# EAGLE design controlmodule (EAGLE 9.6.2)
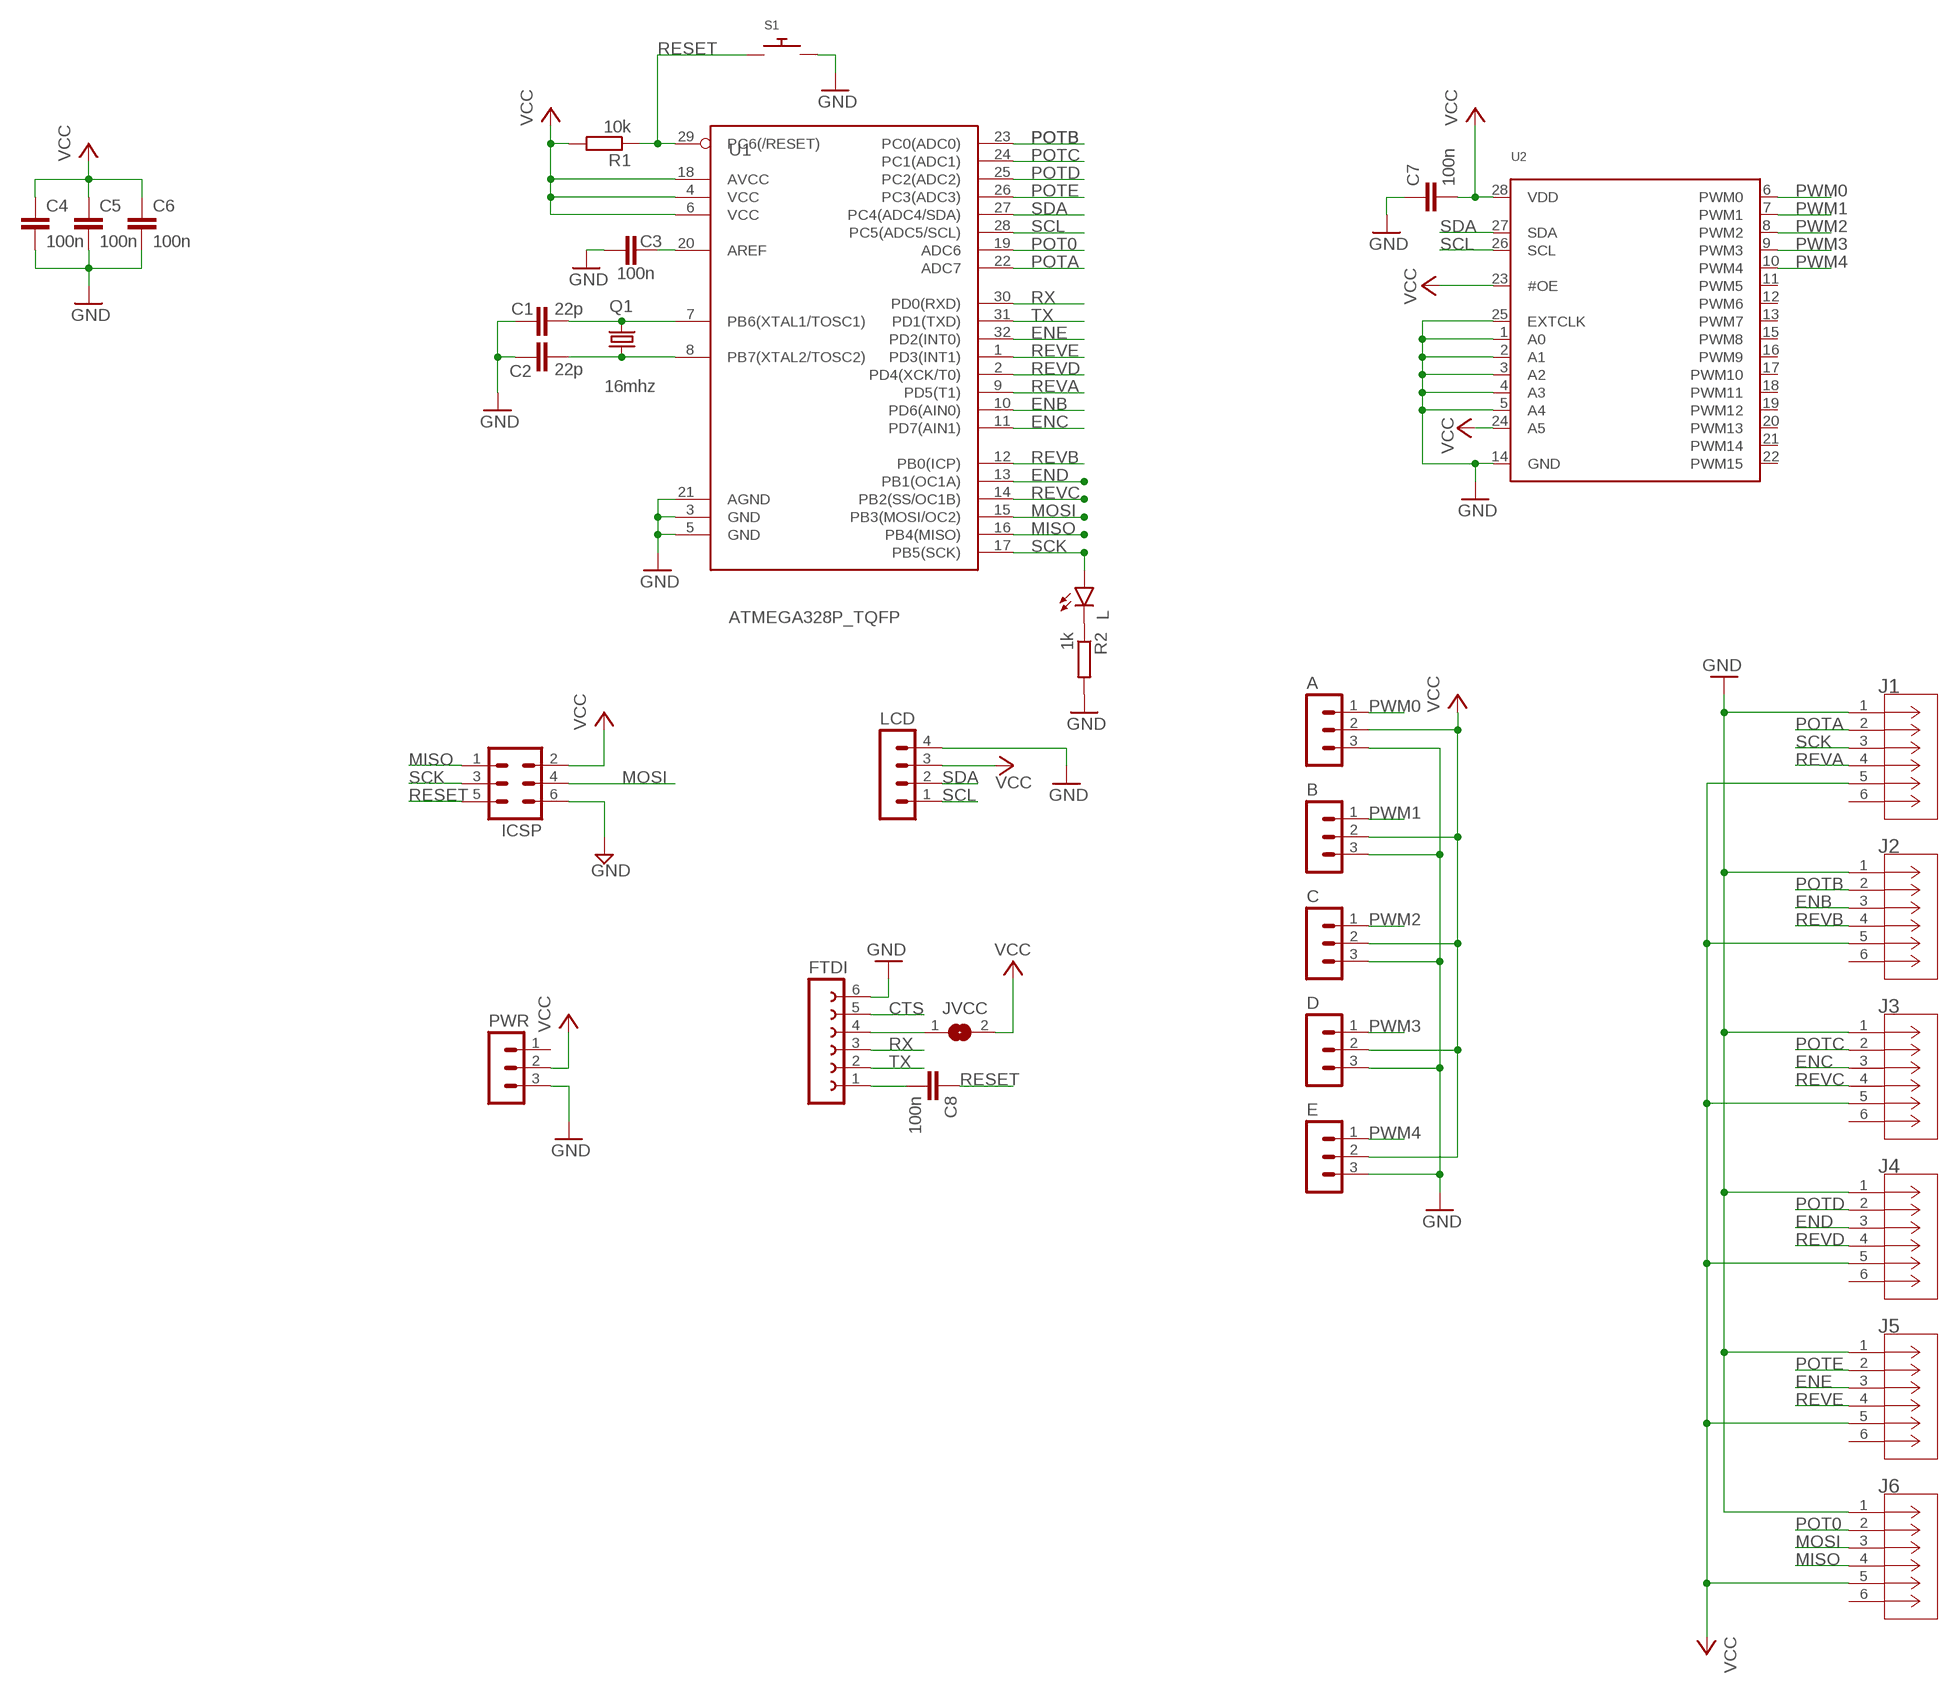
[diagram p0: schematic, sheet 1]

## Parts
A  MOLEX-SL-3PIN  [MOLEX-SL-3PIN]
B  MOLEX-SL-3PIN  [MOLEX-SL-3PIN]
C  MOLEX-SL-3PIN  [MOLEX-SL-3PIN]
C1  22p  C-EUC0805  [C0805]
C2  22p  C-EUC0805  [C0805]
C3  100n  C-EUC0805  [C0805]
C4  100n  C-EUC0805  [C0805]
C5  100n  C-EUC0805  [C0805]
C6  100n  C-EUC0805  [C0805]
C7  100n  C-EUC0805  [C0805]
C8  100n  C-EUC0805  [C0805]
D  MOLEX-SL-3PIN  [MOLEX-SL-3PIN]
E  MOLEX-SL-3PIN  [MOLEX-SL-3PIN]
FTDI  FE06-1  [FE06]
ICSP  MA03-2  [MA03-2]
J1  B6B-PH-K-S(LF)(SN)-JST  [CONN_B6B-PH-K-S_JST]
J2  B6B-PH-K-S(LF)(SN)-JST  [CONN_B6B-PH-K-S_JST]
J3  B6B-PH-K-S(LF)(SN)-JST  [CONN_B6B-PH-K-S_JST]
J4  B6B-PH-K-S(LF)(SN)-JST  [CONN_B6B-PH-K-S_JST]
J5  B6B-PH-K-S(LF)(SN)-JST  [CONN_B6B-PH-K-S_JST]
J6  B6B-PH-K-S(LF)(SN)-JST  [CONN_B6B-PH-K-S_JST]
JVCC  SJ  [SJ]
L  LEDCHIP-LED0805  [CHIP-LED0805]
LCD  MA04-1  [MA04-1]
PWR  MOLEX-SL-3PIN  [MOLEX-SL-3PIN]
Q1  16mhz  CRYSTAL  [HC49UP]
R1  10k  R-EU_R0805  [R0805]
R2  1k  R-EU_R0805  [R0805]
S1  3X4MM-PUHSBUTTON  [3X4MM-PUSHBUTTON]
U1  ATMEGA328P_TQFP  [TQFP32-08]
U2  PCA9685  [TSSOP28]

## Nets
CTS: FTDI.5
ENB: J2.3 U1.10(PD6(AIN0))
ENC: J3.3 U1.11(PD7(AIN1))
END: J4.3 U1.13(PB1(OC1A))
ENE: J5.3 U1.32(PD2(INT0))
GND: A.3 B.3 C1.1 C2.1 C3.2 C4.2 C5.2 C6.2 C7.1 C.3 D.3 E.3 FTDI.6 ICSP.6 J1.1 J2.1 J3.1 J4.1 J5.1 J6.1 LCD.4 PWR.3 R2.2 S1.P$2 U1.3(GND) U1.5(GND) U1.21(AGND) U2.1(A0) U2.2(A1) U2.3(A2) U2.4(A3) U2.5(A4) U2.14(GND) U2.25(EXTCLK)
MISO: ICSP.1 J6.4 U1.16(PB4(MISO))
MOSI: ICSP.4 J6.3 U1.15(PB3(MOSI/OC2))
N$1: FTDI.4 JVCC.1
N$3: L.C R2.1
N$8: C3.1 U1.20(AREF)
N$9: C8.2 FTDI.1
POT0: J6.2 U1.19(ADC6)
POTA: J1.2 U1.22(ADC7)
POTB: J2.2 U1.23(PC0(ADC0))
POTC: J3.2 U1.24(PC1(ADC1))
POTD: J4.2 U1.25(PC2(ADC2))
POTE: J5.2 U1.26(PC3(ADC3))
PWM0: A.1 U2.6(PWM0)
PWM1: B.1 U2.7(PWM1)
PWM2: C.1 U2.8(PWM2)
PWM3: D.1 U2.9(PWM3)
PWM4: E.1 U2.10(PWM4)
RESET: C8.1 ICSP.5 R1.1 S1.P$1 U1.29(PC6(/RESET))
REVA: J1.4 U1.9(PD5(T1))
REVB: J2.4 U1.12(PB0(ICP))
REVC: J3.4 U1.14(PB2(SS/OC1B))
REVD: J4.4 U1.2(PD4(XCK/T0))
REVE: J5.4 U1.1(PD3(INT1))
RX: FTDI.3 U1.30(PD0(RXD))
SCK: ICSP.3 J1.3 L.A U1.17(PB5(SCK))
SCL: LCD.1 U1.28(PC5(ADC5/SCL)) U2.26(SCL)
SDA: LCD.2 U1.27(PC4(ADC4/SDA)) U2.27(SDA)
TX: FTDI.2 U1.31(PD1(TXD))
VCC: A.2 B.2 C4.1 C5.1 C6.1 C7.2 C.2 D.2 E.2 ICSP.2 J1.5 J2.5 J3.5 J4.5 J5.5 J6.5 JVCC.2 LCD.3 PWR.2 R1.2 U1.4(VCC) U1.6(VCC) U1.18(AVCC) U2.23(#OE) U2.24(A5) U2.28(VDD)
XTAL1: C1.2 Q1.2 U1.7(PB6(XTAL1/TOSC1))
XTAL2: C2.2 Q1.1 U1.8(PB7(XTAL2/TOSC2))
Unconnected: J1.6 J2.6 J3.6 J4.6 J5.6 J6.6 PWR.1 U2.11(PWM5) U2.12(PWM6) U2.13(PWM7) U2.15(PWM8) U2.16(PWM9) U2.17(PWM10) U2.18(PWM11) U2.19(PWM12) U2.20(PWM13) U2.21(PWM14) U2.22(PWM15)

## Library data of the parts
A B C D E PWR = bidpl:MOLEX-SL-3PIN
C1-C8 = rcl:C-EU: CAPACITOR, European symbol; SPICEPREFIX: C
FTDI = bidpl:FE06-1: FEMALE HEADER
ICSP = bidpl:MA03-2: PIN HEADER
J1-J6 = bidpl:B6B-PH-K-S(LF)(SN)-JST; BUILT_BY: EMA_Cory; COPYRIGHT: Copyright (C) 2018 Accelerated Designs. All rights reserved; DATASHEET: http://www.jst-mfg.com/product/pdf/eng/ePH.pdf; MANUFACTURER_PART_NUMBER: B6B-PH-K-S(LF)(SN); SOURCELIBRARY: Add_to_database_2020-12-08; VENDOR: JST
JVCC = jumper:SJ: SMD solder JUMPER
L = led:LED: LED OSRAM: - CHIPLED LG R971, LG N971, LY N971, LG Q971, LY Q971, LO R971, LY R971 LH N974, LH R974 LS Q976, LO Q976, LY Q976 LO Q996 - Hyper CHIPLED LW Q18S LB Q993, LB Q99A, LB R99A - SideLED LS A670, LO A670, LY A670, LG A670, LP A670 LB A673, LV A673, LT A673, LW A673 LH A674 LY A675 LS A676, LA A676, LO A676, LY A676, LW A676 LS A679, LY A679, LG A679 - Hyper Micro SIDELED® LS Y876, LA Y876, LO Y876, LY Y876 LT Y87S - SmartLED LW L88C, LW L88S LB L89C, LB L89S, LG L890 LS L89K, LO L89K, LY L89K LS L896, LA L896, LO L896, LY L896 - TOPLED LS T670, LO T670, LY T670, LG T670, LP T670 LSG T670, LSP T670, LSY T670, LOP T670, LYG T670 LG T671, LOG T671, LSG T671 LB T673, LV T673, LT T673, LW T673 LH T674 LS T676, LA T676, LO T676, LY T676, LB T676, LH T676, LSB T676, LW T676 LB T67C, LV T67C, LT T67C, LS T67K, LO T67K, LY T67K, LW E67C LS E67B, LA E67B, LO E67B, LY E67B, LB E67C, LV E67C, LT E67C LW T67C LS T679, LY T679, LG T679 LS T770, LO T770, LY T770, LG T770, LP T770 LB T773, LV T773, LT T773, LW T773 LH T774 LS E675, LA E675, LY E675, LS T675 LS T776, LA T776, LO T776, LY T776, LB T776 LHGB T686 LT T68C, LB T68C - Hyper Mini TOPLED® LB M676 - Mini TOPLED Santana® LG M470 LS M47K, LO M47K, LY M47K Source: http://www.osram.convergy.de LUXEON: - LUMILED® LXK2-PW12-R00, LXK2-PW12-S00, LXK2-PW14-U00, LXK2-PW14-V00 LXK2-PM12-R00, LXK2-PM12-S00, LXK2-PM14-U00 LXK2-PE12-Q00, LXK2-PE12-R00, LXK2-PE12-S00, LXK2-PE14-T00, LXK2-PE14-U00 LXK2-PB12-K00, LXK2-PB12-L00, LXK2-PB12-M00, LXK2-PB14-N00, LXK2-PB14-P00, LXK2-PB14-Q00 LXK2-PR12-L00, LXK2-PR12-M00, LXK2-PR14-Q00, LXK2-PR14-R00 LXK2-PD12-Q00, LXK2-PD12-R00, LXK2-PD12-S00 LXK2-PH12-R00, LXK2-PH12-S00 LXK2-PL12-P00, LXK2-PL12-Q00, LXK2-PL12-R00 Source: www.luxeon.com KINGBRIGHT: KA-3528ASYC Source: www.kingbright.com
LCD = bidpl:MA04-1: PIN HEADER
Q1 = bidpl:CRYSTAL: CRYSTAL
R1 R2 = rcl:R-EU_: RESISTOR, European symbol; SPICEPREFIX: R
S1 = bidpl:3X4MM-PUHSBUTTON: https://ae01.alicdn.com/kf/HTB1vkExQpXXXXbFXFXXq6xXFXXXk/10PCS-2Pin-SMD-Mini-Button-Switch-Phone-Side-Push-3X4MM-Micro-Button-Switch-used-for-key.jpg_960x960.jpg
U1 = bidpl:ATMEGA328P_TQFP: Popular 328P in QFP Storefront component: ATmega328 - TQFP <https://www.sparkfun.com/products/13448> (COM-13448) Datasheet <http://www.sparkfun.com/datasheets/Components/SMD/ATMega328.pdf> SparkFun Products SparkFun RedBoard - Programmed with Arduino <https://www.sparkfun.com/products/12757> (DEV-12757) Arduino Pro Mini 328 - 5V/16MHz <https://www.sparkfun.com/products/11113> (DEV-11113) Arduino Pro Mini 328 - 3.3V/8MHz <https://www.sparkfun.com/products/11114> (DEV-11114) SparkFun OpenLog <https://www.sparkfun.com/products/13712> (DEV-13712) SparkFun MicroView - OLED Arduino Module <https://www.sparkfun.com/products/12923> (DEV-12923) SparkFun Digital Sandbox <https://www.sparkfun.com/products/12651> (DEV-12651) SparkFun PicoBoard <https://www.sparkfun.com/products/11888> (WIG-11888) Arduino Fio <https://www.sparkfun.com/products/10116> (DEV-10116) LilyPad Arduino 328 Main Board <https://www.sparkfun.com/products/13342> (DEV-13342) SparkFun RedStick <https://www.sparkfun.com/products/13741> (DEV-13741) LilyPad MP3 <https://www.sparkfun.com/products/11013> (DEV-11013) LilyPad Arduino SimpleSnap <https://www.sparkfun.com/products/10941> (DEV-10941) SparkFun Stepoko <https://www.sparkfun.com/products/13899> (ROB-13899) SparkFun Geiger Counter <https://www.sparkfun.com/products/11345> (SEN-11345) SparkFun EL Sequencer <https://www.sparkfun.com/products/12781> (COM-12781) Arduino Pro 328 - 5V/16MHz <https://www.sparkfun.com/products/10915> (DEV-10915) CryptoCape <https://www.sparkfun.com/products/12773> (DEV-12773) SparkFun IR Thermometer Evaluation Board - MLX90614 <https://www.sparkfun.com/products/10740> (SEN-10740) SparkFun RedBot Mainboard <https://www.sparkfun.com/products/12097> (ROB-12097) Arduino Pro 328 - 3.3V/8MHz <https://www.sparkfun.com/products/10914> (DEV-10914) SparkFun Block for Intel® Edison - Arduino <https://www.sparkfun.com/products/13036> (DEV-13036) SparkFun Simon Says - Surface Mount Soldering Kit <https://www.sparkfun.com/products/10935> (KIT-10935) SparkFun 7-Segment Serial Display - Red <https://www.sparkfun.com/products/11441> (COM-11441) SparkFun 7-Segment Serial Display - White <https://www.sparkfun.com/products/11629> (COM-11629) SparkFun 7-Segment Serial Display - Yellow <https://www.sparkfun.com/products/11443> (COM-11443) SparkFun 7-Segment Serial Display - Kelly Green <https://www.sparkfun.com/products/11440> (COM-11440) SparkFun 7-Segment Serial Display - Blue <https://www.sparkfun.com/products/11442> (COM-11442) SparkFun OpenSegment Serial Display - 20mm (Blue) <https://www.sparkfun.com/products/11647> (COM-11647) SparkFun OpenSegment Serial Display - 20mm (Green) <https://www.sparkfun.com/products/11646> (COM-11646) SparkFun OpenSegment Serial Display - 20mm (White) <https://www.sparkfun.com/products/11648> (COM-11648) SparkFun OpenSegment Serial Display - 20mm (Red) <https://www.sparkfun.com/products/11644> (COM-11644) SparkFun OpenSegment Serial Display - 20mm (Yellow) <https://www.sparkfun.com/products/11645> (COM-11645) SparkFun OpenSegment Shield <https://www.sparkfun.com/products/13190> (DEV-13190); PROD_ID: IC-09069
U2 = bidpl:PCA9685: PCA9685 - 16 Channel 12-Bit I2C PWM Controller 5.0V tolerant 16 channel, 12-bit I2C PWM controller with 25mA per output (max. 400mA total) Digikey: 568-5931-1-ND

## Board
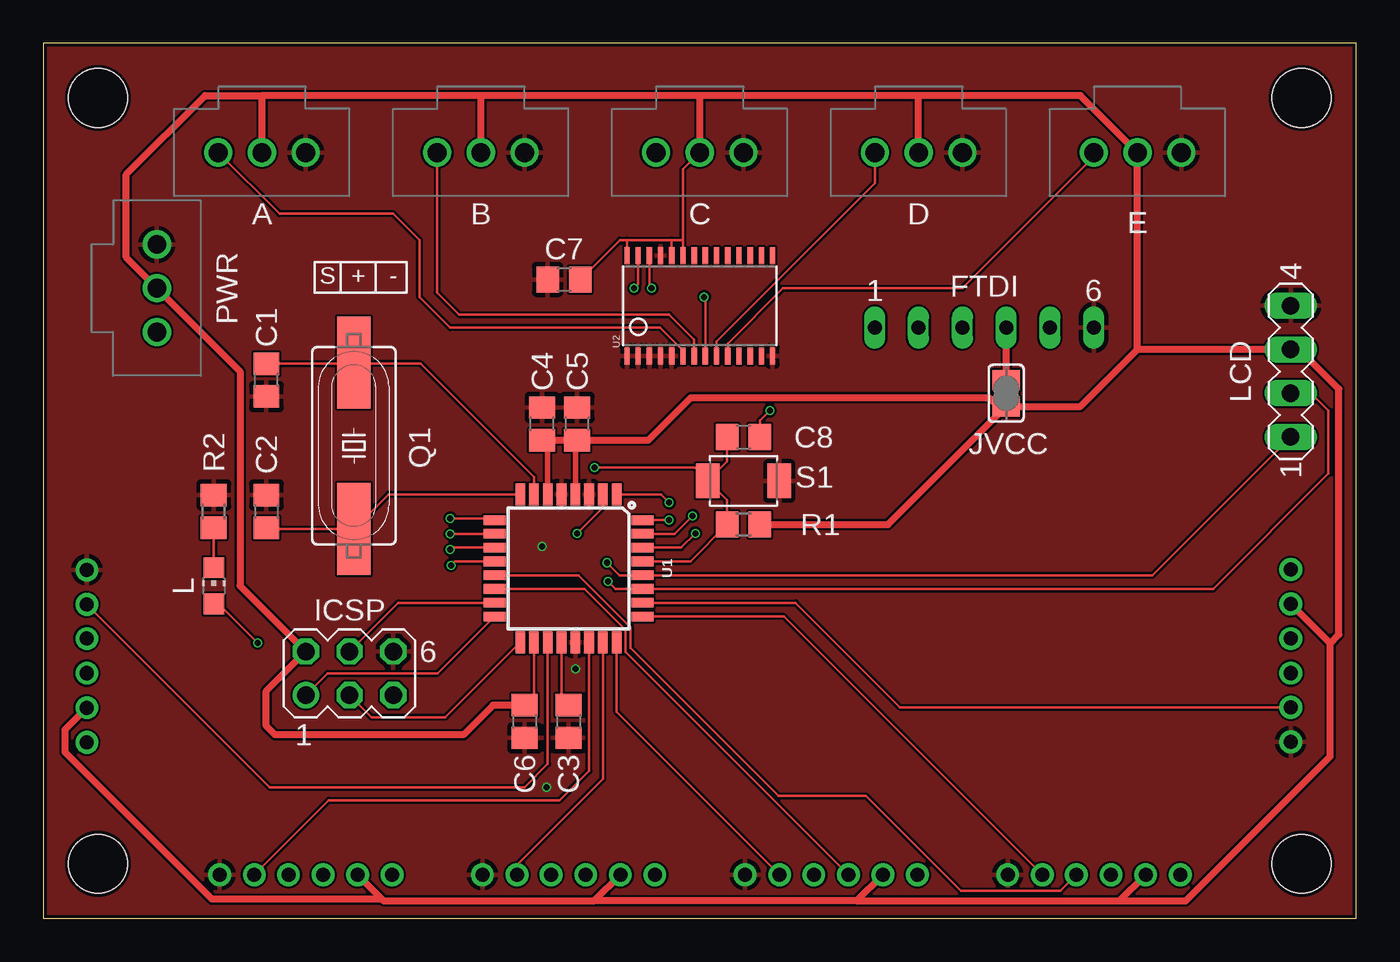
[diagram p1: board, top side]
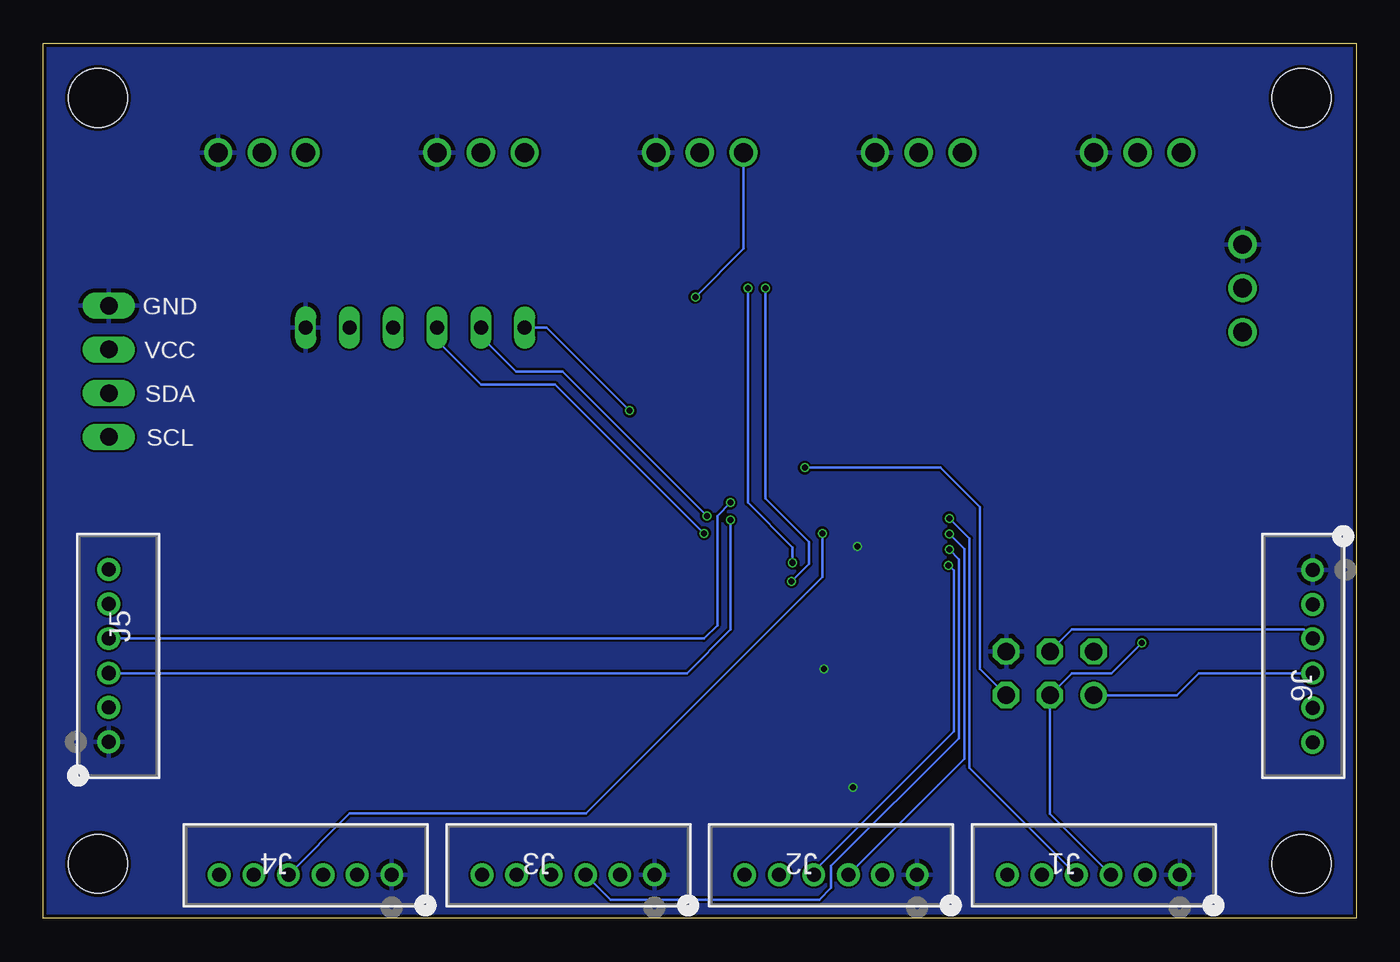
[diagram p2: board, bottom side, seen from below]

Size 76.2 x 50.8 mm. Coordinates in mm from the lower left corner, seen from the top.
Outline: 0,0 76.18,0 76.2,50.8 0,50.8 0,0
Copper layers (1*16): Top 0.035559375mm / dielectric 1.6mm / Bottom 0.035559375mm
Design rules "jlcpcb2layer": minimum track width 5mil, minimum drill 12mil, track to track 5mil, track to pad 5mil, pad to pad 5mil, via to via 5mil, smd to smd 5mil, copper to edge 8mil, drill to drill 6mil, minimum pad ring 5mil, minimum via ring 3mil, stop-mask expansion 2.5mil, vias tented up to drill 0mil, thermal gap 10mil
Holes 3.4 mm at 3.17,3.17 73.03,3.17 73.03,47.62 3.17,47.62

### Footprints (pad centres in the part's own frame; a part is rotated, then mirrored left to right if it is on the bottom)
MOLEX-SL-3PIN = drill 1.092: 1 -2.54,0; 2 0,0; 3 2.54,0
C0805 = smd 1.3 x 1.5: 1 -0.95,0; 2 0.95,0
FE06 = drill 0.813 long: 1 -6.35,0; 2 -3.81,0; 3 -1.27,0; 4 1.27,0; 5 3.81,0; 6 6.35,0
MA03-2 = drill 1.016: 1 -2.54,-1.27 | drill 1.016 octagon: 2 -2.54,1.27; 3 0,-1.27; 4 0,1.27; 5 2.54,-1.27; 6 2.54,1.27
CONN_B6B-PH-K-S_JST = drill 0.813 pad 1.321: 1 -4.991,0; 2 -2.985,0; 3 -1.003,0; 4 1.003,0; 5 3.01,0; 6 5.016,0
SJ = smd 1.168 x 1.6: 1 -0.762,0; 2 0.762,0
CHIP-LED0805 = smd 1.2 x 1.2: A 0,-1.05; C 0,1.05
MA04-1 = drill 1.016 long: 1 -3.81,0; 2 -1.27,0; 3 1.27,0; 4 3.81,0
HC49UP = smd 5.334 x 1.93: 1 -4.826,0; 2 4.826,0
R0805 = smd 1.3 x 1.5: 1 -0.95,0; 2 0.95,0
3X4MM-PUSHBUTTON = smd 1.35 x 2: P$1 -2.075,0; P$2 2.075,0
TQFP32-08 = smd 1.27 x 0.559: 1 -4.293,2.8; 2 -4.293,2; 3 -4.293,1.2; 4 -4.293,0.4; 5 -4.293,-0.4; 6 -4.293,-1.2; 7 -4.293,-2; 8 -4.293,-2.8; 17 4.293,-2.8; 18 4.293,-2; 19 4.293,-1.2; 20 4.293,-0.4; 21 4.293,0.4; 22 4.293,1.2; 23 4.293,2; 24 4.293,2.8 | smd 0.559 x 1.27: 9 -2.8,-4.293; 10 -2,-4.293; 11 -1.2,-4.293; 12 -0.4,-4.293; 13 0.4,-4.293; 14 1.2,-4.293; 15 2,-4.293; 16 2.8,-4.293; 25 2.8,4.293; 26 2,4.293; 27 1.2,4.293; 28 0.4,4.293; 29 -0.4,4.293; 30 -1.2,4.293; 31 -2,4.293; 32 -2.8,4.293
TSSOP28 = smd 0.305 x 0.991: 1 -4.225,-2.918; 2 -3.575,-2.918; 3 -2.925,-2.918; 4 -2.275,-2.918; 5 -1.625,-2.918; 6 -0.975,-2.918; 7 -0.325,-2.918; 8 0.325,-2.918; 9 0.975,-2.918; 10 1.625,-2.918; 11 2.275,-2.918; 12 2.925,-2.918; 13 3.575,-2.918; 14 4.225,-2.918; 15 4.225,2.918; 16 3.575,2.918; 17 2.925,2.918; 18 2.275,2.918; 19 1.625,2.918; 20 0.975,2.918; 21 0.325,2.918; 22 -0.325,2.918; 23 -0.975,2.918; 24 -1.625,2.918; 25 -2.275,2.918; 26 -2.925,2.918; 27 -3.575,2.918; 28 -4.225,2.918

### Placement (x,y rotation side)
A  12.7,44.45 0 top
B  25.4,44.45 0 top
C  38.1,44.45 0 top
C1  12.95,31.24 90 top
C2  12.95,23.62 270 top
C3  30.48,11.43 270 top
C4  28.96,28.7 90 top
C5  30.99,28.7 90 top
C6  27.94,11.43 270 top
C7  30.23,37.08 0 top
C8  40.64,27.94 0 top
D  50.8,44.45 0 top
E  63.5,44.45 0 top
FTDI  54.61,34.29 0 top
ICSP  17.78,14.22 0 top
J1  15.24,2.54 180 bottom
J2  30.48,2.54 180 bottom
J3  45.72,2.54 180 bottom
J4  60.96,2.54 180 bottom
J5  72.39,15.24 90 bottom
J6  2.54,15.24 270 bottom
JVCC  55.88,30.48 270 top
L  9.91,19.3 0 top
LCD  72.39,31.75 90 top
PWR  6.6,36.58 90 top
Q1  18.03,27.43 90 top
R1  40.64,22.86 0 top
R2  9.91,23.62 90 top
S1  40.64,25.4 0 top
U1  30.48,20.32 270 top
U2  38.1,35.56 0 top

### Tracks (layer width: path | path; a pad name or v marks a point on that pad's centre or on a via)
ENB  (via drill 0.35)
  Top 0.152: v23.62,22.31 v23.63,22.32 U1.10
  Bottom 0.152: J2.3 22.76,9.26 22.76,21.45 v23.62,22.31
ENC  (via drill 0.35)
  Top 0.152: v23.62,21.4 23.74,21.52 U1.11
  Bottom 0.152: J3.3 43.27,1.09 31.17,1.09 30.48,1.78 30.48,3.05 23.06,10.46 23.06,20.84 v23.62,21.4
END
  Top 0.152: U1.13 31.06,19.92 34.09,16.88 34.09,15.69 42.67,7.11 47.75,7.11 53.26,1.6 59.02,1.6 J4.3
ENE  (via drill 0.35)
  Top 0.152: U1.32 v36.32,23.12 v36.32,23.11
  Bottom 0.152: v36.32,23.11 36.32,16.76 38.85,14.24 J5.3
GND  (via drill 0.35)
  other vias: 30.89,14.48 28.96,21.59 29.21,7.62
  pour Top: -0.51,-0.51 76.71,-0.51 76.71,51.05 -0.51,51.05
  pour Bottom: -1.27,50.8 -1.27,-1.27 77.47,-1.27 77.47,50.8
MISO
  Top 0.152: ICSP.1 16.51,14.22 22.89,14.22 U1.16
  Bottom 0.152: J6.4 9.13,14.24 10.41,12.95 ICSP.1
MOSI
  Top 0.152: ICSP.4 20.61,18.32 U1.15
  Bottom 0.152: J6.3 3.06,16.76 16.51,16.76 ICSP.4
N$1
  Top 0.406: JVCC.1 FTDI.4
N$3
  Top 0.152: R2.1 L.C
N$8
  Top 0.152: C3.1 30.08,12.78 U1.20
N$9  (via drill 0.35)
  Top 0.152: v42.16,29.46 41.59,28.89 C8.2
  Bottom 0.152: FTDI.1 46.99,34.29 v42.16,29.46
POT0
  Top 0.152: U1.19 29.28,8.96 27.94,7.62 13.14,7.62 J6.2
POTA
  Top 0.152: J1.2 16.57,6.86 29.97,6.86 31.68,8.57 U1.22
POTB
  Top 0.152: J2.2 27.5,3.11 32.48,8.1 U1.23
POTC
  Top 0.152: J3.2 33.28,11.99 U1.24
POTD
  Top 0.152: J4.2 42.99,17.52 U1.25
POTE
  Top 0.152: U1.26 43.66,18.32 49.72,12.26 J5.2
PWM0
  Top 0.152: U2.6 37.12,32.96 35.8,34.29 23.62,34.29 21.84,36.07 21.84,39.37 20.32,40.89 13.72,40.89 A.1
PWM1
  Top 0.152: B.1 22.86,36.32 24.13,35.05 36.32,35.05 37.77,33.6 U2.7
PWM2  (via drill 0.35)
  Top 0.152: U2.8 38.42,36 v38.35,36.07
  Bottom 0.152: v38.35,36.07 35.56,38.86 C.1
PWM3
  Top 0.152: D.1 48.26,42.67 39.08,33.49 U2.9
PWM4
  Top 0.152: U2.10 39.73,33.38 42.93,36.58 53.34,36.58 60.96,44.2 E.1
RESET  (via drill 0.35)
  Top 0.152: U1.29 37.55,20.72 R1.1 39.69,24.27 S1.P$1 | S1.P$1 39.69,26.52 C8.1 | S1.P$1 37.8,26.16 v32,26.16
  Bottom 0.152: ICSP.5 21.84,14.48 21.84,23.88 24.13,26.16 v32,26.16
REVA  (via drill 0.35)
  Top 0.152: v23.62,23.22 26.09,23.22 U1.9
  Bottom 0.152: J1.4 22.45,8.75 22.45,22.05 v23.62,23.22
REVB  (via drill 0.35)
  Top 0.152: v23.67,20.5 23.89,20.72 U1.12
  Bottom 0.152: J2.4 31.48,2.73 23.37,10.85 23.37,20.19 v23.67,20.5
REVC
  Top 0.152: J3.4 33.79,15.47 33.79,16.76 31.43,19.12 U1.14
REVD  (via drill 0.35)
  Top 0.152: v30.99,22.35 32.48,23.84 U1.2
  Bottom 0.152: J4.4 58.41,6.1 44.7,6.1 30.99,19.81 v30.99,22.35
REVE  (via drill 0.35)
  Top 0.152: U1.1 35.84,24.61 v36.32,24.13
  Bottom 0.152: v36.32,24.13 37.08,23.37 37.08,17.02 37.86,16.24 J5.4
RX  (via drill 0.35)
  Top 0.152: U1.30 37.01,21.52 v37.85,22.35
  Bottom 0.152: v37.85,22.35 46.48,30.99 50.8,30.99 53.34,33.53 FTDI.3
SCK  (via drill 0.35)
  Top 0.152: U1.17 23.34,11.68 19.05,11.68 ICSP.3 | L.A 10.19,18.25 v12.45,16
  Bottom 0.152: J1.3 17.78,6.08 ICSP.3 16.51,14.22 14.22,14.22 v12.45,16
SCL  (via drill 0.35)
  Top 0.152: LCD.1 64.37,19.92 U1.28 33.44,19.92 v32.71,20.65 | v35.31,36.58 35.17,36.71 U2.26
  Bottom 0.152: v32.71,20.65 32.71,21.53 35.31,24.13 v35.31,36.58
SDA  (via drill 0.35)
  Top 0.152: LCD.2 73.56,30.48 74.58,29.46 74.58,25.81 67.89,19.12 U1.27 33.2,19.12 v32.77,19.56 | U2.27 34.52,36.81 v34.29,36.58
  Bottom 0.152: v32.77,19.56 31.75,20.57 31.75,21.84 34.29,24.38 v34.29,36.58
TX  (via drill 0.35)
  Top 0.152: U1.31 36.64,22.32 v37.69,23.37
  Bottom 0.152: v37.69,23.37 46.07,31.75 48.77,31.75 50.8,33.78 FTDI.2
VCC
  Top 0.152: C6.1 28.48,12.92 U1.18 | 30.88,27.64 C5.1 | 29.28,27.43 C4.1 | U2.23 37.12,39.37 | 37.12,39.37 37.12,43.48 C.2 | C7.2 33.46,39.37 33.88,39.37 | 33.88,39.37 36.48,39.37 | 36.48,39.37 37.12,39.37 | U2.28 33.88,39.37 | U2.24 36.48,39.37
  Top 0.305: U1.4 30.88,27.43 30.88,27.64 | U1.6 29.28,27.43
  Top 0.406: J1.5 19.67,1.12 | 19.67,1.12 19.77,1.02 31.97,1.02 | J2.5 31.97,1.02 | 47.21,1.02 31.97,1.02 | 47.21,1.02 J3.5 | 47.21,1.02 62.45,1.02 | 62.45,1.02 J4.5 | 62.45,1.02 66.29,1.02 74.68,9.4 74.68,15.96 | 74.68,15.96 J5.5 | 19.67,1.12 9.8,1.12 1.27,9.65 1.27,10.96 J6.5 | 50.8,47.75 60.2,47.75 E.2 63.5,33.02 | 50.8,47.75 38.1,47.75 | 38.1,47.75 25.4,47.75 | 25.4,47.75 12.7,47.75 | 12.7,47.75 9.4,47.75 4.83,43.18 4.83,38.35 PWR.2 11.43,31.75 11.43,19.3 ICSP.2 12.95,13.21 12.95,11.18 13.46,10.67 24.38,10.67 26.1,12.38 C6.1 | D.2 50.8,47.75 | C.2 38.1,47.75 | B.2 25.4,47.75 | A.2 12.7,47.75 | 63.5,33.02 60.2,29.72 JVCC.2 55.63,29.46 | 63.5,33.02 LCD.3 72.9,33.02 75.18,30.73 75.18,16.47 74.68,15.96 | R1.2 49.02,22.86 55.63,29.46 | C4.1 30.56,27.75 30.88,27.43 | C5.1 35.12,27.75 37.59,30.23 54.86,30.23 55.63,29.46
XTAL1
  Top 0.152: C1.2 17.97,32.19 | 17.97,32.19 Q1.2 | U1.7 28.48,25.62 21.91,32.19 17.97,32.19
XTAL2
  Top 0.152: C2.2 13.02,22.61 Q1.1 20.04,24.61 U1.8

### Text on the board
tPlace: S | + | -
bPlace: GND | VCC | SDA | SCL